# Altium schematic sheet MCU.SchDoc: MCU
size A4; Date: *******; ApprovedBy: *******; Author: *******; CompanyName: *******; Engineer: *******; Organization: *******; Address1: *******; Address2: *******; Address3: *******; Address4: *******; DocumentNumber: 1; Revision: *******; SheetNumber: 1; SheetTotal: 4; CurrentTime: *******; CurrentDate: *******; Time: *******; DocumentFullPathAndName: *******; DocumentName: *******; ModifiedDate: *******; ImagePath: *******; ProjectName: *******; Application_BuildNumber: *******
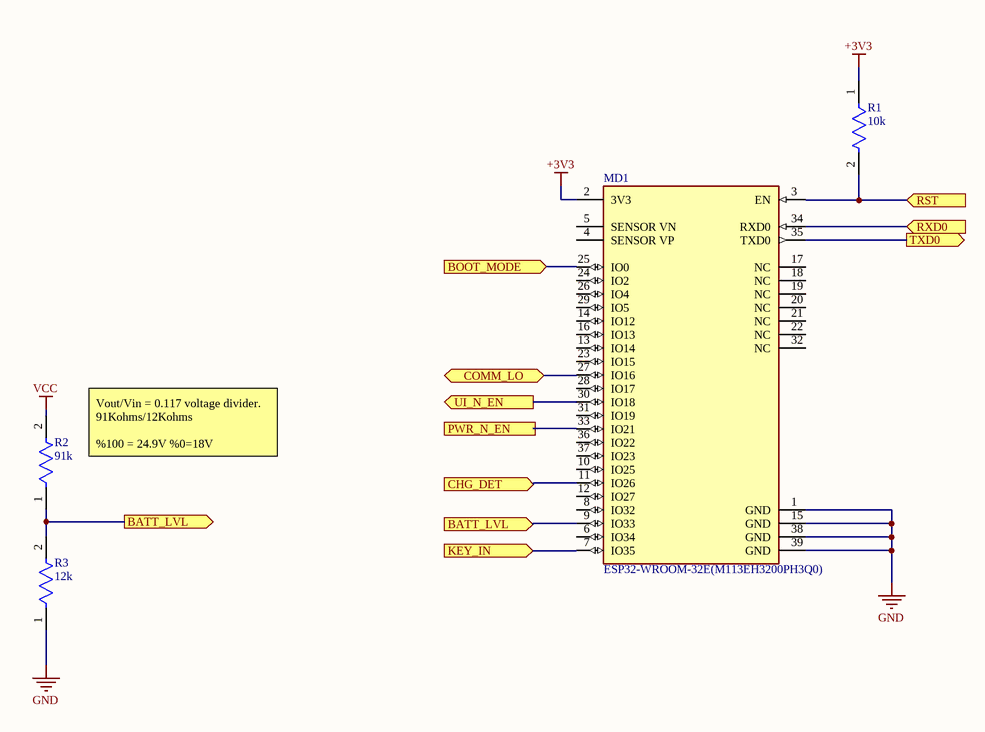
[diagram p0: MCU.SchDoc]

## Parts
MD1  ESP32-WROOM-32E(M113EH3200PH3Q0)  [FP-ESP32-WROOM-32E_M113EH-MFG]
R1  10k  [FP-RP731J-MFG]
R2  91k  [FP-RP731J-MFG]
R3  12k  [FP-RP731J-MFG]

## Ports
BATT_LVL (in, see MCU[1C]), BATT_LVL (out, see MCU[2C]), BOOT_MODE (in, see CONNECTORS[3B]), CHG_DET (in, see CONNECTORS[2C]), COMM_LO (bidir, see COMM LEVEL SHIFTER[2B]), KEY_IN (in, see CONNECTORS[1B]), PWR_N_EN (out, see POWER[1B]), RST (in, see CONNECTORS[3B]), RXD0 (in, see CONNECTORS[3B]), TXD0 (out, see CONNECTORS[3B]), UI_N_EN (out, see POWER[1D])

## Nets
+3V3: MD1.2(3V3) R1.1
GND: MD1.1(GND) MD1.15(GND) MD1.38(GND) MD1.39(GND) R3.1
VCC: R2.2
BATT_LVL: MD1.9(IO33) R2.1 R3.2 ; port BATT_LVL
BOOT_MODE: MD1.25(IO0) ; port BOOT_MODE
CHG_DET: MD1.11(IO26) ; port CHG_DET
COMM_LO: MD1.27(IO16) ; port COMM_LO
KEY_IN: MD1.7(IO35) ; port KEY_IN
PWR_N_EN: MD1.33(IO21) ; port PWR_N_EN
RST: MD1.3(EN) R1.2 ; port RST
RXD0: MD1.34(RXD0) ; port RXD0
TXD0: MD1.35(TXD0) ; port TXD0
UI_N_EN: MD1.30(IO18) ; port UI_N_EN

Not connected (* = marked no-connect by the designer): MD1 4(SENSOR_VP) 5(SENSOR_VN) 6(IO34) 8(IO32) 10(IO25) 12(IO27) 13(IO14) 14(IO12) 16(IO13) 17(NC) 18(NC) 19(NC) 20(NC) 21(NC) 22(NC) 23(IO15) 24(IO2) 26(IO4) 28(IO17) 29(IO5) 31(IO19) 32(NC) 36(IO22) 37(IO23)

## Notes on the sheet
- (near R2) Vout/Vin = 0.117 voltage divider. 91Kohms/12Kohms
  %100 = 24.9V %0=18V
- Title:
- Drawn By:
- Page Contents:
- Checked By:
- Size:
- Date:
- File:
- License:
- Email:
- A4
- Number:
- Time:
- Revision:
- Sheet
- Website:
- of

## Library data of the parts
MD1 = CMP-194065-000012-1: RX TXRX MOD WIFI TRACE ANT SMD; LCSC Part #: C701341
R1 = CMP-03211-008596-1: TE CONNECTIVITY / HOLSWORTHY SMD Chip Resistor, Thin Film, 8.45Ω, 50 V, 0603 [1608 Metric], 100 mW, 0.1% , RP73 Series; Manufacturer Part Number: RP73D1J8R45BTDG; Temperature Coefficient: 15ppm/°C; Resistance: 10kΩ; Voltage Rating: 75V; Value: 10kΩ; Power Rating: 0.1W; Temperature: -55°C to +105°C; octopart_url: https://octopart.com/rp73d1j8r45btdg-te+connectivity-42630912; packaging: cut tape; Manufacturer: TE Connectivity; Device Class L2: Resistors; Series: RP73; Temperature Range High: +105°C; Package: RP731J; ComponentLink2Description: Datasheet; Octopart: https://octopart.com/rp73d1j8r45btdg-te+connectivity-42630912; Height: 0.55mm; Ipc Land Pattern Name: RESC15580X45; ComponentLink2URL: https://www.te.com/commerce/DocumentDelivery/DDEController?Action=srchrtrv&DocNm=1773272&DocType=DS&DocLang=English; Device Class L3: Chip SMD Resistors; Category: Res; Temperature Range Low: -55°C; RoHS: TRUE; Device Class L1: Passive Components; Tolerance: 0.1%; Composition: Thin Film; Automotive: No; Lead Free: Yes; Case/Package: 603; LCSC Part #: *
R2 = CMP-03211-008596-1: TE CONNECTIVITY / HOLSWORTHY SMD Chip Resistor, Thin Film, 8.45Ω, 50 V, 0603 [1608 Metric], 100 mW, 0.1% , RP73 Series; Manufacturer Part Number: RP73D1J8R45BTDG; Temperature Coefficient: 15ppm/°C; Resistance: 91kΩ; Voltage Rating: 75V; Value: 91kΩ; Power Rating: 0.1W; Temperature: -55°C to +105°C; octopart_url: https://octopart.com/rp73d1j8r45btdg-te+connectivity-42630912; packaging: cut tape; Manufacturer: TE Connectivity; Device Class L2: Resistors; Series: RP73; Temperature Range High: +105°C; Package: 603; ComponentLink2Description: Datasheet; Octopart: https://octopart.com/rp73d1j8r45btdg-te+connectivity-42630912; Height: 0.55mm; Ipc Land Pattern Name: RESC15580X45; ComponentLink2URL: https://www.te.com/commerce/DocumentDelivery/DDEController?Action=srchrtrv&DocNm=1773272&DocType=DS&DocLang=English; Device Class L3: Chip SMD Resistors; Category: Res; Temperature Range Low: -55°C; RoHS: TRUE; Device Class L1: Passive Components; Tolerance: 0.1%; Composition: Thin Film; Automotive: No; Lead Free: Yes; Case/Package: 603; LCSC Part #: *
R3 = CMP-03211-008596-1: TE CONNECTIVITY / HOLSWORTHY SMD Chip Resistor, Thin Film, 8.45Ω, 50 V, 0603 [1608 Metric], 100 mW, 0.1% , RP73 Series; Manufacturer Part Number: RP73D1J8R45BTDG; Temperature Coefficient: 15ppm/°C; Resistance: 12kΩ; Voltage Rating: 75V; Value: 12kΩ; Power Rating: 0.1W; Temperature: -55°C to +105°C; octopart_url: https://octopart.com/rp73d1j8r45btdg-te+connectivity-42630912; packaging: cut tape; Manufacturer: TE Connectivity; Device Class L2: Resistors; Series: RP73; Temperature Range High: +105°C; Package: 603; ComponentLink2Description: Datasheet; Octopart: https://octopart.com/rp73d1j8r45btdg-te+connectivity-42630912; Height: 0.55mm; Ipc Land Pattern Name: RESC15580X45; ComponentLink2URL: https://www.te.com/commerce/DocumentDelivery/DDEController?Action=srchrtrv&DocNm=1773272&DocType=DS&DocLang=English; Device Class L3: Chip SMD Resistors; Category: Res; Temperature Range Low: -55°C; RoHS: TRUE; Device Class L1: Passive Components; Tolerance: 0.1%; Composition: Thin Film; Automotive: No; Lead Free: Yes; Case/Package: 603; LCSC Part #: *